# Altium project UdemyCourse.PrjPcb (part 1 of 3)
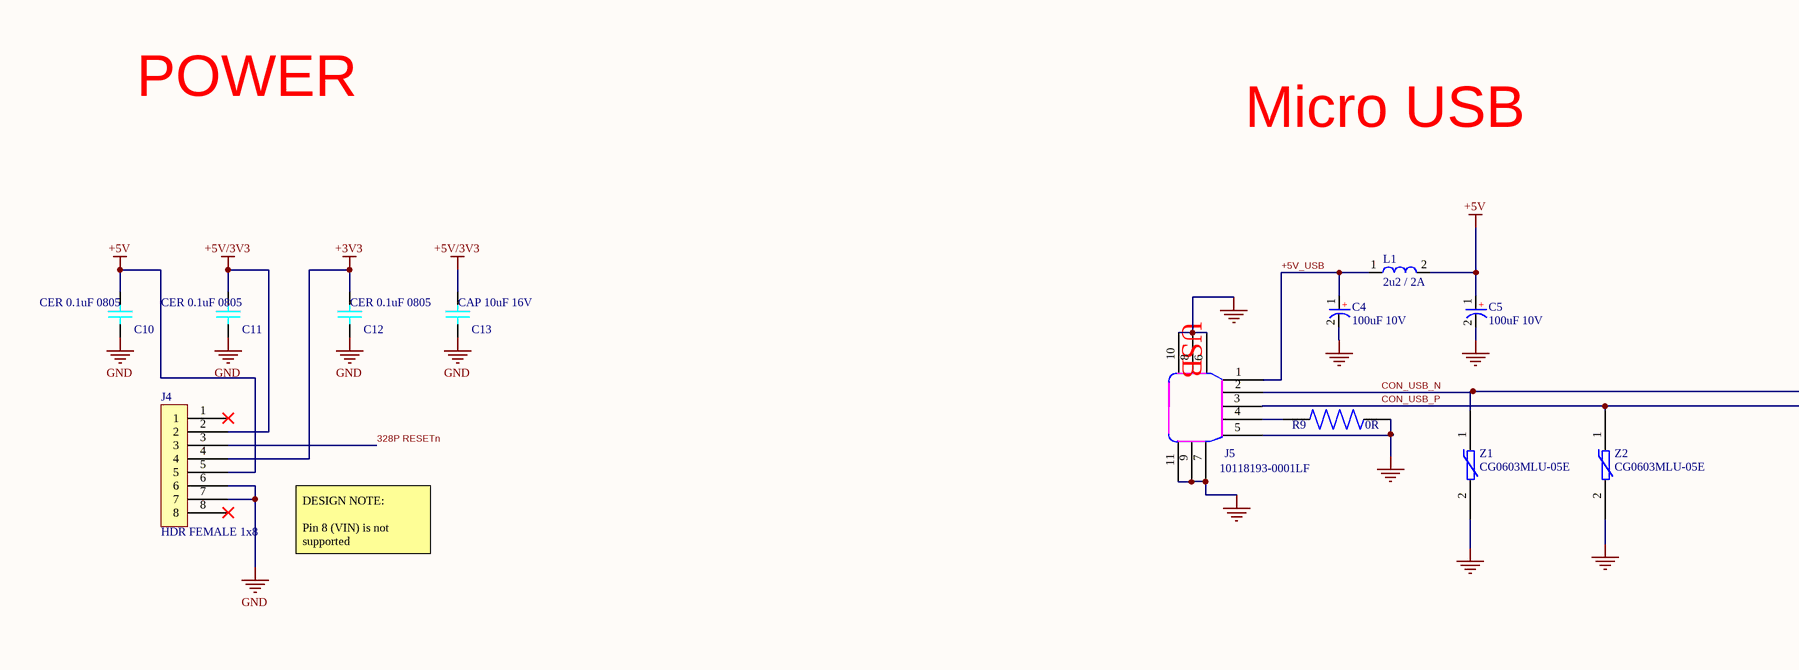
[diagram p0: 28Pins.SchDoc, top left]
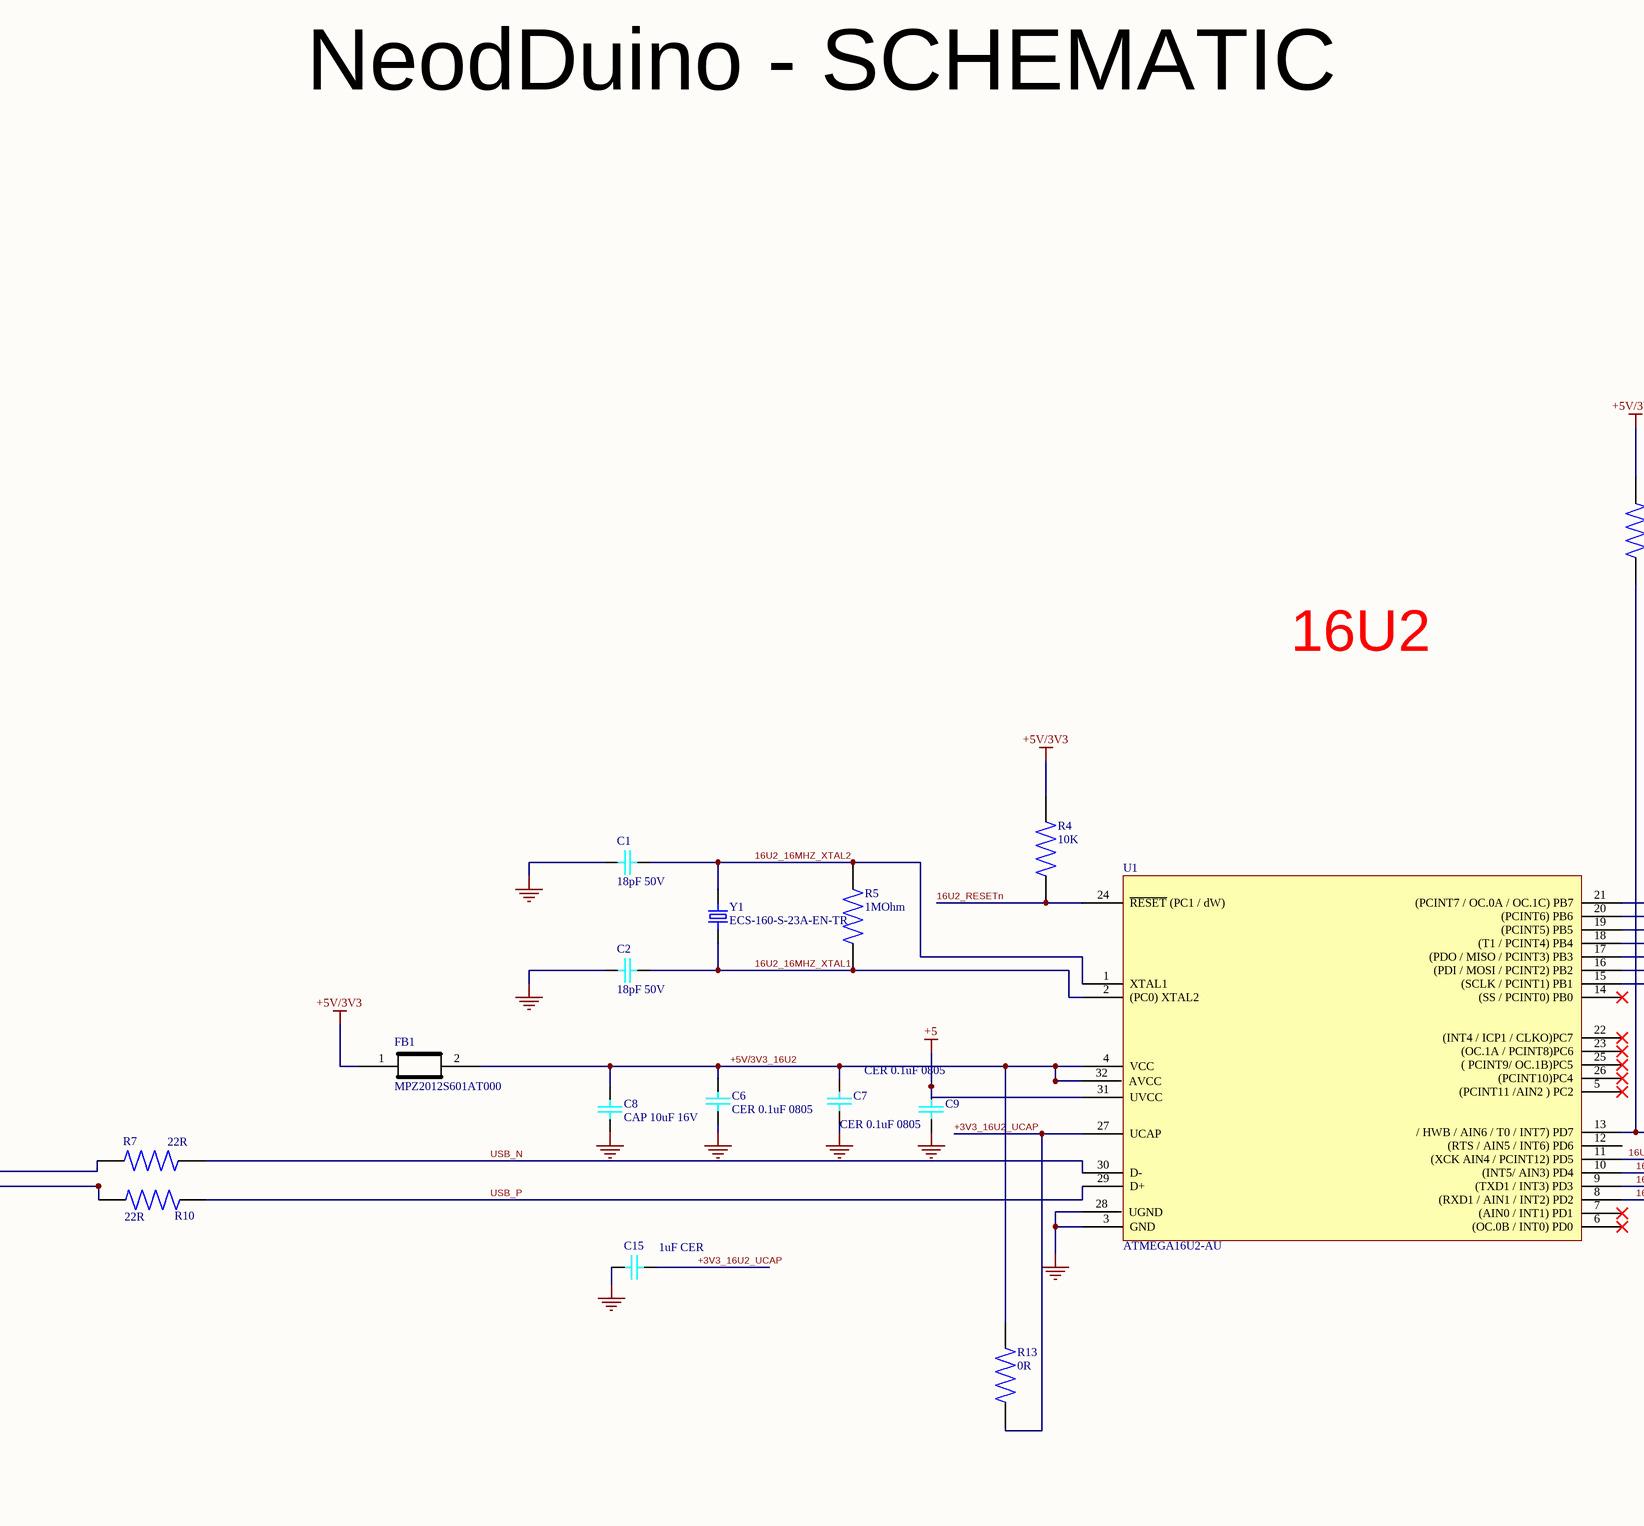
[diagram p1: 28Pins.SchDoc, top middle]
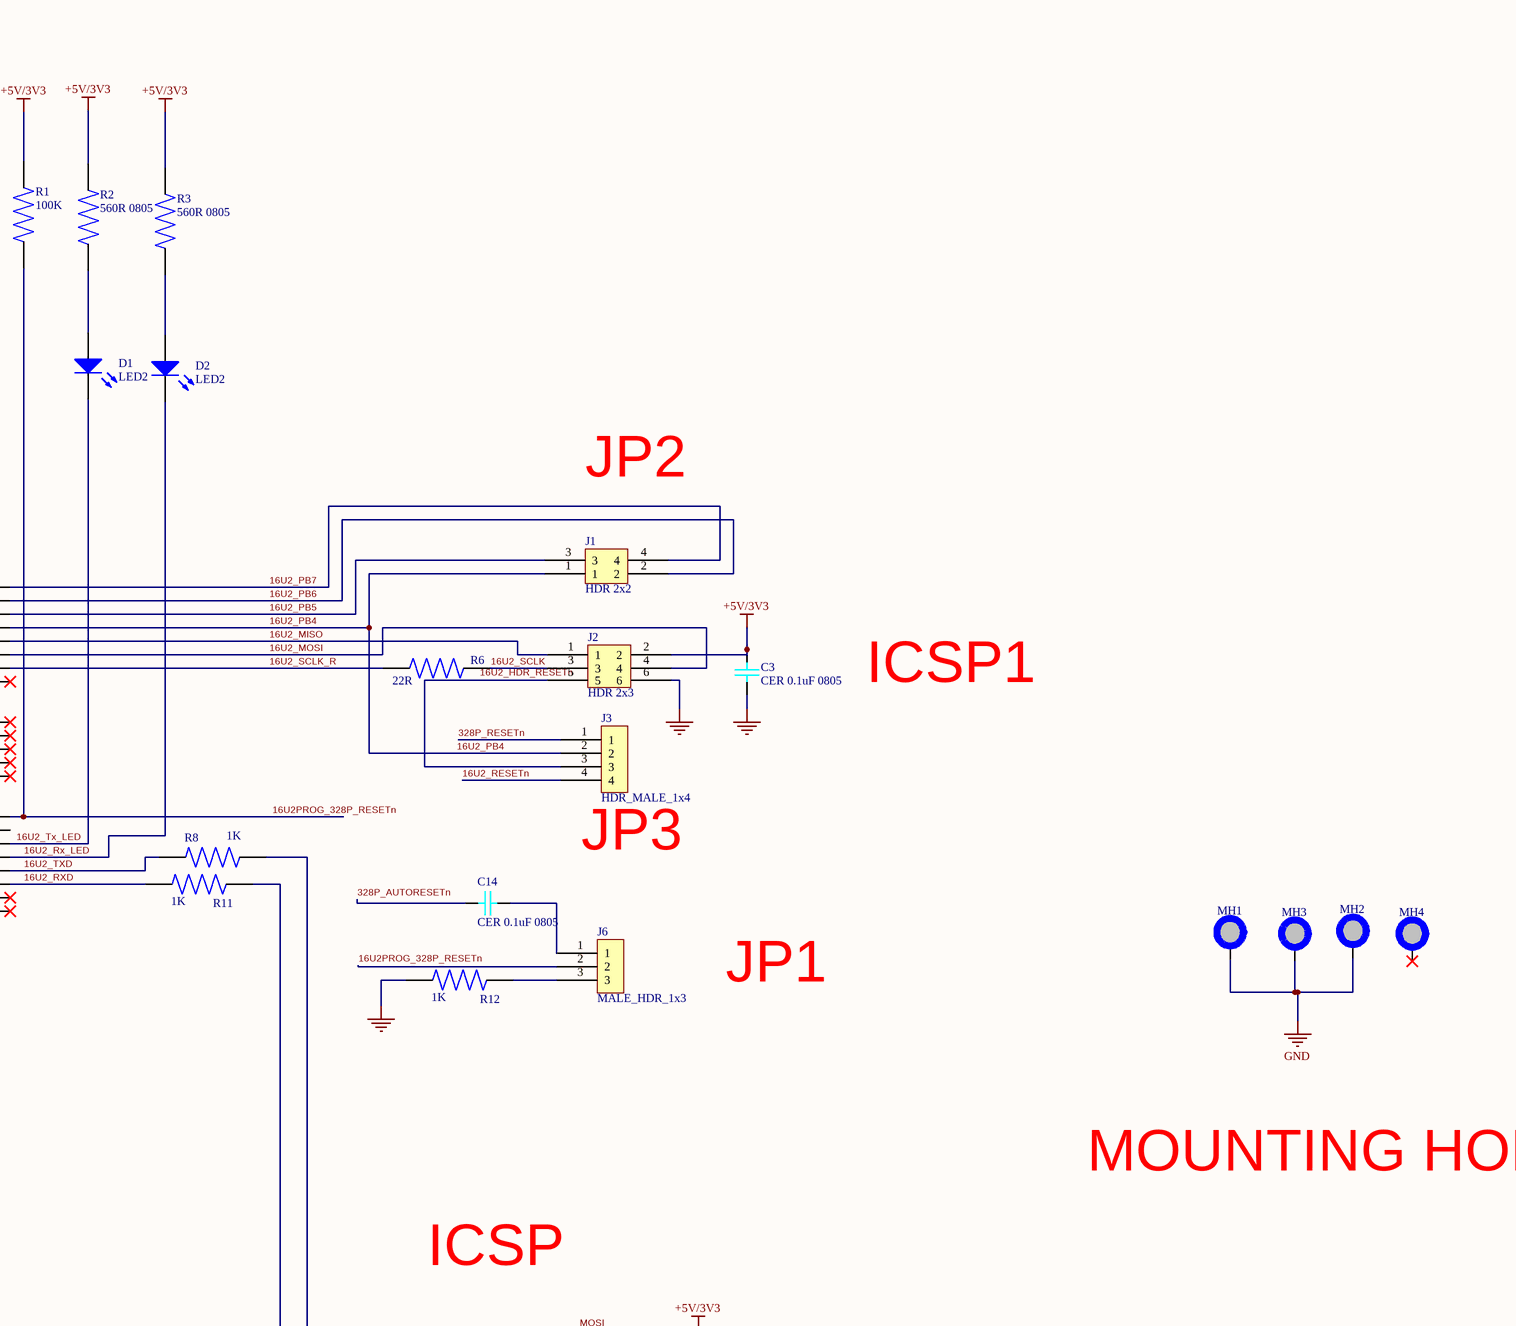
[diagram p2: 28Pins.SchDoc, top right]
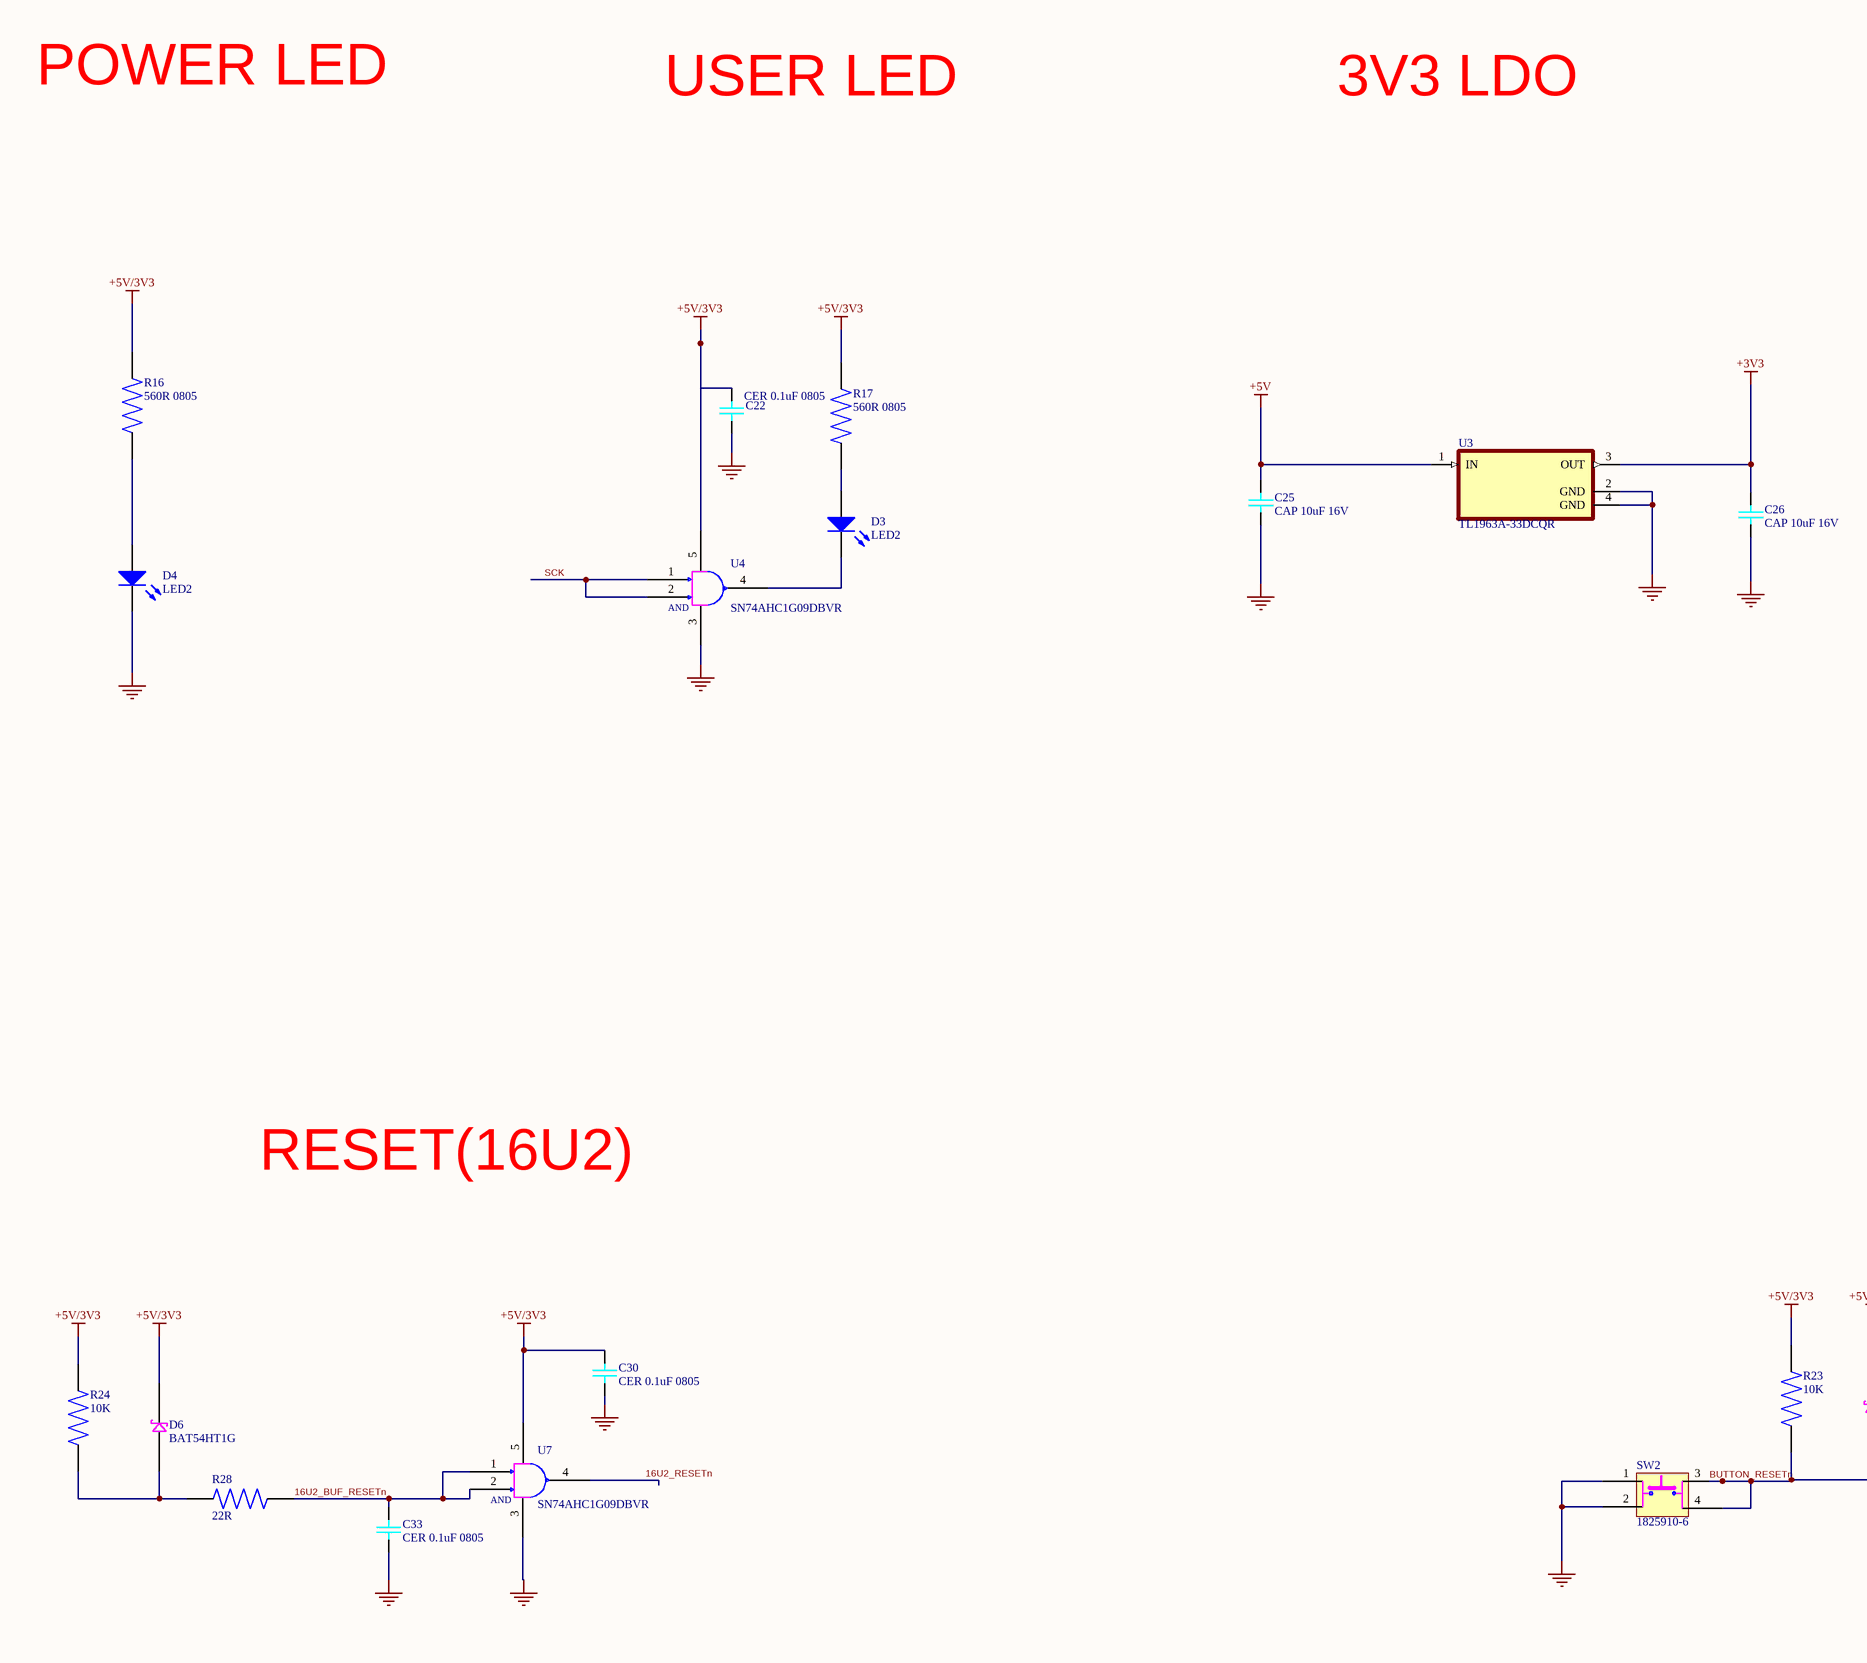
[diagram p3: 28Pins.SchDoc, bottom left]
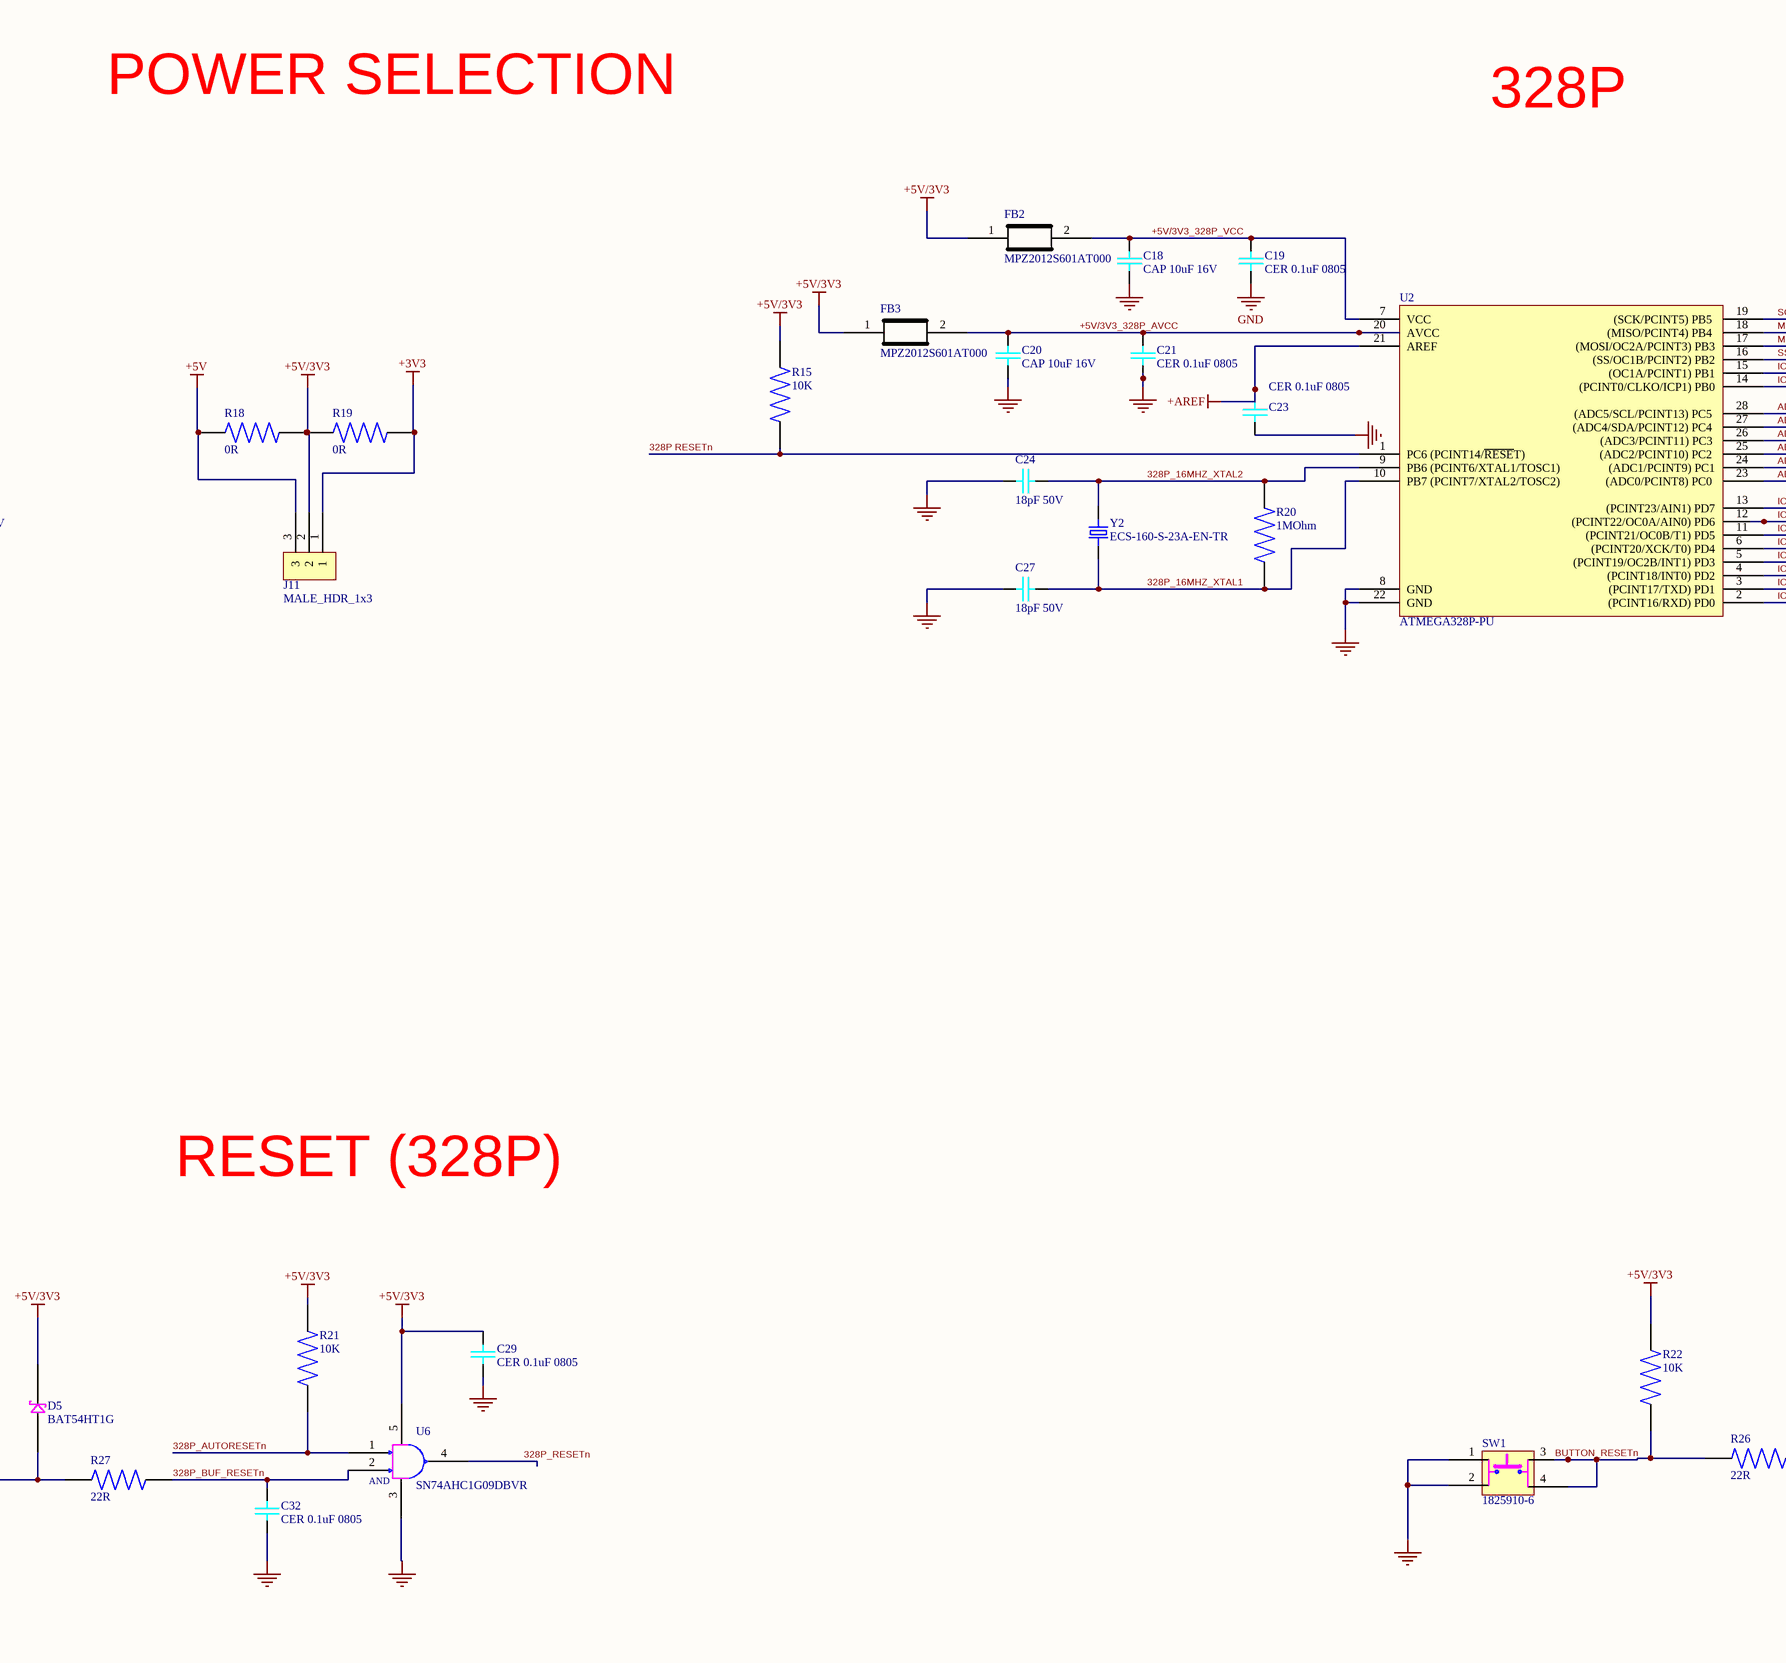
[diagram p4: 28Pins.SchDoc, bottom middle]
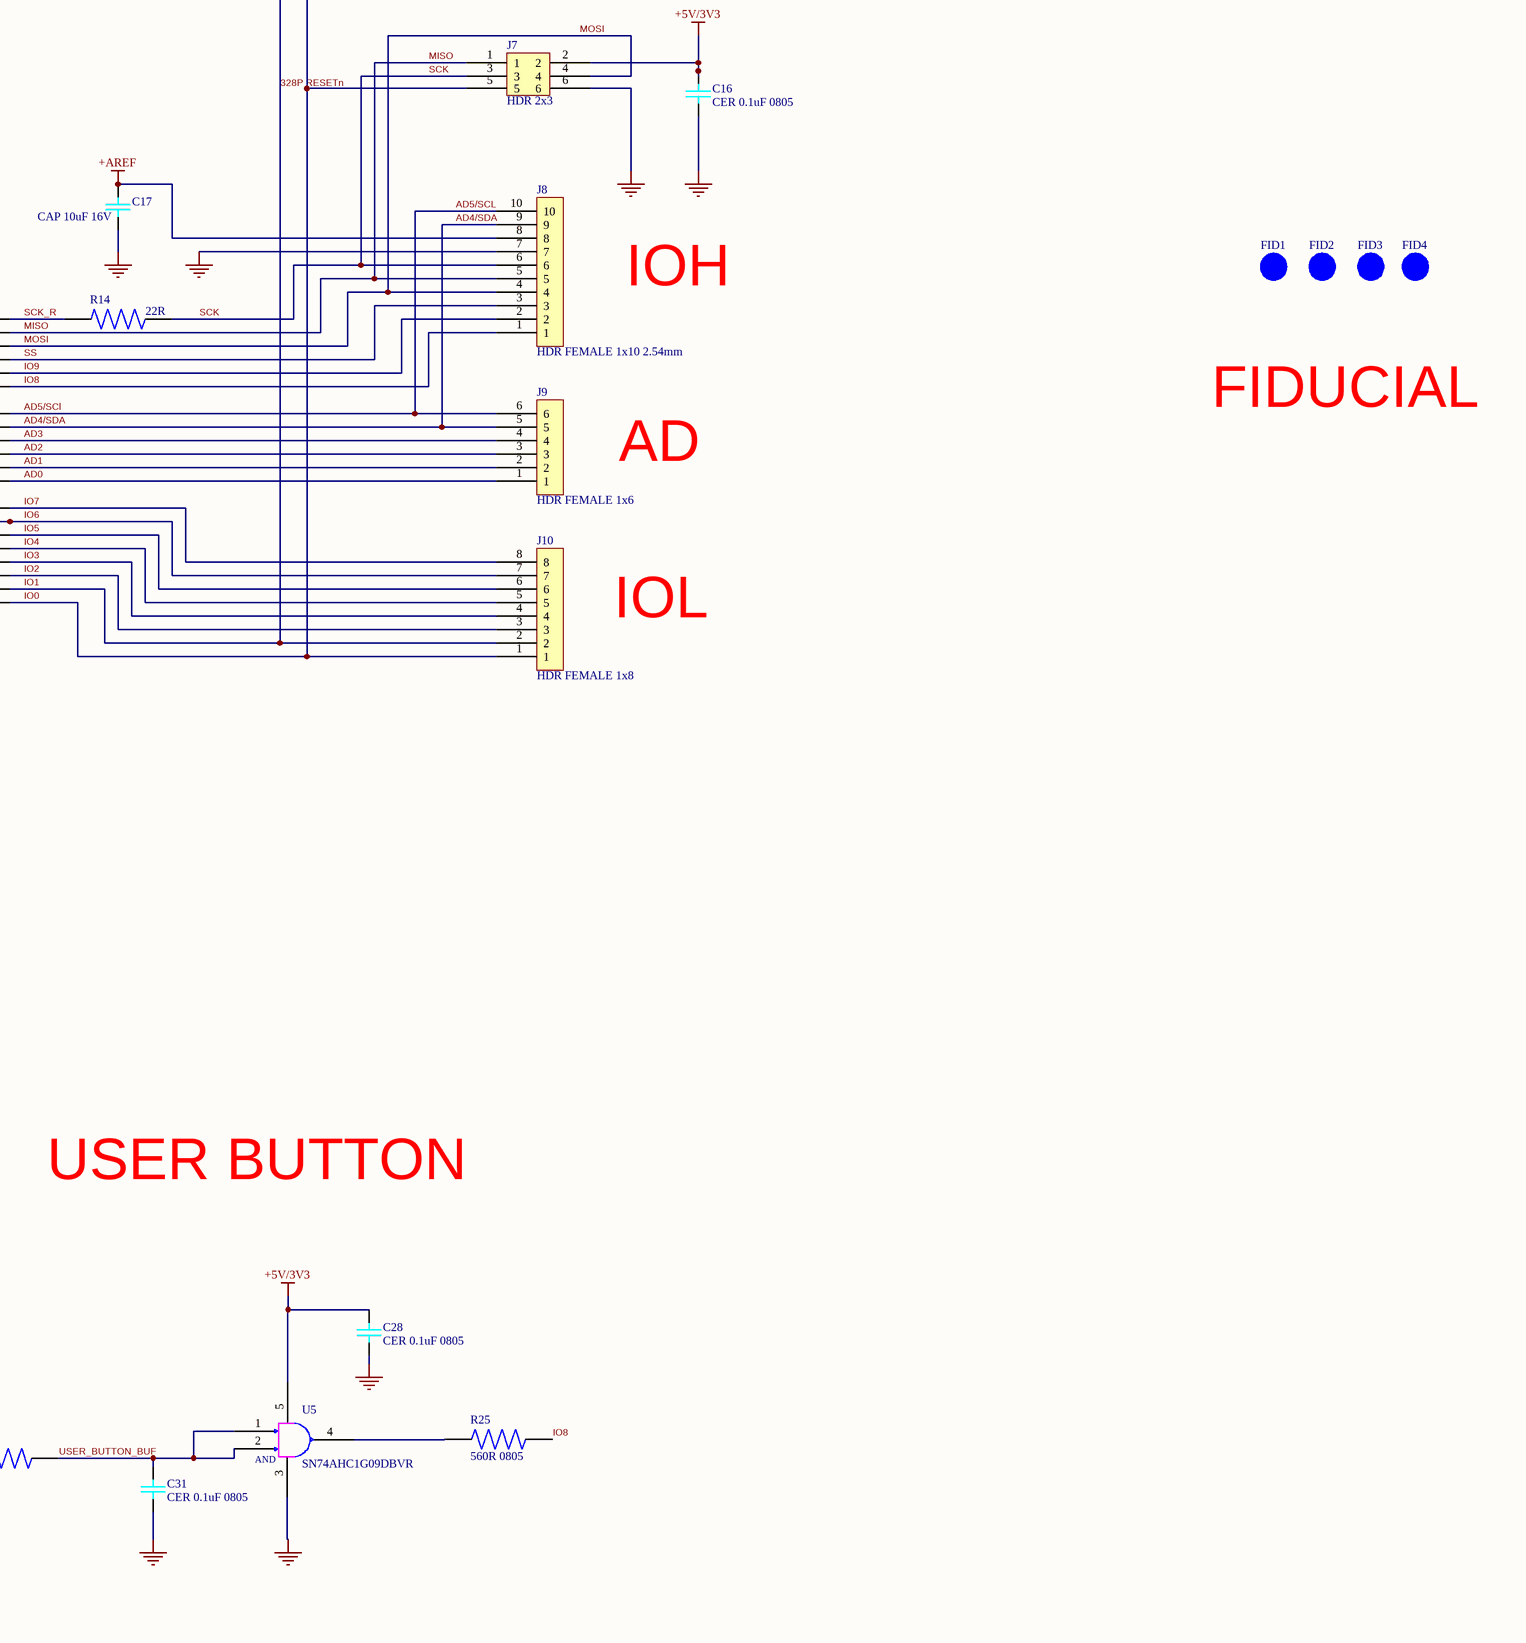
[diagram p5: 28Pins.SchDoc, bottom right]
NotFitted: NF; Title: NeoDuino
1 sheet, 103 parts. Net scope: global (net labels, ports and power ports of the same name join across sheets).
Board file: 28Pin_PCB.PcbDoc

## Sheet 28Pins.SchDoc: NeoDuino
size A0

### Parts
C1  18pF 50V  [C0805]
C2  18pF 50V  [C0805]
C3  CER 0.1uF 0805  [C0805]
C4  100uF 10V  [C_ALUMINIUM_100u]
C5  100uF 10V  [C_ALUMINIUM_100u]
C6  CER 0.1uF 0805  [C0805]
C7  CER 0.1uF 0805  [C0805]
C8  CAP 10uF 16V  [C0805_10uF]
C9  CER 0.1uF 0805  [C0805]
C10  CER 0.1uF 0805  [C0805]
C11  CER 0.1uF 0805  [C0805]
C12  CER 0.1uF 0805  [C0805]
C13  CAP 10uF 16V  [C0805_10uF]
C14  CER 0.1uF 0805  [C0805]
C15  1uF CER  [C0805]
C16  CER 0.1uF 0805  [C0805]
C17  CAP 10uF 16V  [C0805_10uF]
C18  CAP 10uF 16V  [C0805_10uF]
C19  CER 0.1uF 0805  [C0805]
C20  CAP 10uF 16V  [C0805_10uF]
C21  CER 0.1uF 0805  [C0805]
C22  CER 0.1uF 0805  [C0805]
C23  CER 0.1uF 0805  [C0805]
C24  18pF 50V  [C0805]
C25  CAP 10uF 16V  [C0805_10uF]
C26  CAP 10uF 16V  [C0805_10uF]
C27  18pF 50V  [C0805]
C28  CER 0.1uF 0805  [C0805]
C29  CER 0.1uF 0805  [C0805]
C30  CER 0.1uF 0805  [C0805]
C31  CER 0.1uF 0805  [C0805]
C32  CER 0.1uF 0805  [C0805]
C33  CER 0.1uF 0805  [C0805]
D1  LED2  [3.2X1.6X1.1]
D2  LED2  [3.2X1.6X1.1]
D3  LED2  [3.2X1.6X1.1]
D4  LED2  [3.2X1.6X1.1]
D5  BAT54HT1G  [SOD323_DIODE]
D6  BAT54HT1G  [SOD323_DIODE]
FB1  MPZ2012S601AT000  [C0805]
FB2  MPZ2012S601AT000  [C0805]
FB3  MPZ2012S601AT000  [C0805]
FID1  FID_1MMC  [FID_40x120MM]  (value not drawn)  (no BOM)
FID2  FID_1MMC  [FID_40x120MM]  (value not drawn)  (no BOM)
FID3  FID_1MMC  [FID_40x120MM]  (value not drawn)  (no BOM)
FID4  FID_1MMC  [FID_40x120MM]  (value not drawn)  (no BOM)
J1  HDR 2x2  [HDR_2x2_2.54MM]
J2  HDR 2x3  [HDR_2x3_2.54MM]
J3  HDR_MALE_1x4  [HDR_MALE_1x4]
J4  HDR FEMALE 1x8  [HDR_FEMALE_1x8]
J5  10118193-0001LF  [USB_micro]
J6  MALE_HDR_1x3  [HDR_MALE_1x3]
J7  HDR 2x3  [HDR_2x3_2.54MM]
J8  HDR FEMALE 1x10 2.54mm  [HDR_FEMALE_1x10]
J9  HDR FEMALE 1x6  [HDR_FEMALE_1x6]
J10  HDR FEMALE 1x8  [HDR_FEMALE_1x8]
J11  MALE_HDR_1x3  [HDR_MALE_1x3]
L1  2u2 / 2A  [CL10INDUCTOR]
MH1  MH_7.4_3.3MM  [MH_7.4MM_3.2MMDRILL_NOPT]  (value not drawn)  (no BOM)
MH2  MH_7.4_3.3MM  [MH_7.4MM_3.2MMDRILL_NOPT]  (value not drawn)  (no BOM)
MH3  MH_7.4_3.3MM  [MH_7.4MM_3.2MMDRILL_NOPT]  (value not drawn)  (no BOM)
MH4  MH_7.4_3.3MM  [MH_7.4MM_3.2MMDRILL_NOPT]  (value not drawn)  (no BOM)
R1  100K  [RESC2012X65N]
R2  560R 0805  [RESC2012X65N]
R3  560R 0805  [RESC2012X65N]
R4  10K  [RESC2012X65N]
R5  1MOhm  [RESC2012X65N]
R6  22R  [RESC2012X65N]
R7  22R  [RESC2012X65N]
R8  1K  [RESC2012X65N]
R9  0R  [RESC2012X65N]
R10  22R  [RESC2012X65N]
R11  1K  [RESC2012X65N]
R12  1K  [RESC2012X65N]
R13  0R  [RESC2012X65N]
R14  22R  [RESC2012X65N]
R15  10K  [RESC2012X65N]
R16  560R 0805  [RESC2012X65N]
R17  560R 0805  [RESC2012X65N]
R18  0R  [RESC2012X65N]
R19  0R  [RESC2012X65N]
R20  1MOhm  [RESC2012X65N]
R21  10K  [RESC2012X65N]
R22  10K  [RESC2012X65N]
R23  10K  [RESC2012X65N]
R24  10K  [RESC2012X65N]
R25  560R 0805  [RESC2012X65N]
R26  22R  [RESC2012X65N]
R27  22R  [RESC2012X65N]
R28  22R  [RESC2012X65N]
SW1  1825910-6  [SW_ 1825910-6]
SW2  1825910-6  [SW_ 1825910-6]
U1  ATMEGA16U2-AU  [TQFP32]
U2  ATMEGA328P-PU  [DIP28_328P]
U3  TL1963A-33DCQR  [SOT127P706X180-6N]
U4  SN74AHC1G09DBVR  [DBV_SOP_23_5]
U5  SN74AHC1G09DBVR  [DBV_SOP_23_5]
U6  SN74AHC1G09DBVR  [DBV_SOP_23_5]
U7  SN74AHC1G09DBVR  [DBV_SOP_23_5]
Y1  ECS-160-S-23A-EN-TR  [CRYSTAL_16MHz]
Y2  ECS-160-S-23A-EN-TR  [XTAL_ECS-160-S-23A-EN-TR]
Z1  CG0603MLU-05E  [R0603]
Z2  CG0603MLU-05E  [R0603]

### Nets
+3V3: C12.1 C26.2 J4.4 J11.1 R19.2 U3.3(OUT)
+5: C9.2 U1.31(UVCC)
+5V: C5.1 C10.1 C25.2 J4.5 J11.3 L1.2 R18.1 U3.1(IN)
+5V/3V3: C3.2 C11.1 C13.2 C16.2 C22.2 C28.1 C29.1 C30.1 D5.1 D6.1 FB1.1 FB2.1 FB3.1 J2.2 J4.2 J7.2 J11.2 R1.2 R2.1 R3.1 R4.2 R15.2 R16.2 R17.2 R18.2 R19.1 R21.2 R22.1 R23.1 R24.1 U4.5 U5.5 U6.5 U7.5
+AREF: C17.2 C23.2 J8.8 U2.21(AREF)
GND: C1.1 C2.1 C3.1 C4.2 C5.2 C6.1 C7.1 C8.1 C9.1 C10.2 C11.2 C12.2 C13.1 C15.1 C16.1 C17.1 C18.1 C19.1 C20.1 C21.1 C22.1 C23.1 C24.1 C25.1 C26.1 C27.1 C28.2 C29.2 C30.2 C31.1 C32.1 C33.1 D4.2(K) J2.6 J4.6 J4.7 J5.5 J5.6 J5.7 J5.8 J5.9 J5.10 J5.11 J7.6 J8.7 MH1.1 MH2.1 MH3.1 R9.2 R12.1 SW1.1 SW1.2 SW2.1 SW2.2 U1.3(GND) U1.28(UGND) U2.8(GND) U2.22(GND) U3.2(GND) U3.4(GND) U4.3 U5.3 U6.3 U7.3 Z1.2 Z2.2
16U2_16MHZ_XTAL1: C2.2 R5.1 U1.2((PC0)_XTAL2) Y1.1(IN/OUT)
16U2_16MHZ_XTAL2: C1.2 R5.2 U1.1(XTAL1) Y1.2(OUT/IN)
16U2_BUF_RESETn: C33.2 R28.2 U7.1 U7.2
16U2_MISO: J2.1 U1.17((PDO_/_MISO_/_PCINT3)_PB3)
16U2_MOSI: J2.4 U1.16((PDI_/_MOSI_/_PCINT2)_PB2)
16U2_PB4: J1.1 J3.2 U1.18((T1_/_PCINT4)_PB4)
16U2_PB5: J1.3 U1.19((PCINT5)_PB5)
16U2_PB6: J1.2 U1.20((PCINT6)_PB6)
16U2_PB7: J1.4 U1.21((PCINT7_/_OC.0A_/_OC.1C)_PB7)
16U2_RESETn: J3.4 R4.1 U1.24(~{RESET}_(PC1_/_dW)) U7.4
16U2_Rx_LED: D2.2(K) U1.10((INT5/_AIN3)_PD4)
16U2_RXD: R11.1 U1.8((RXD1_/_AIN1_/_INT2)_PD2)
16U2_SCLK: J2.3 R6.2
16U2_SCLK_R: R6.1 U1.15((SCLK_/_PCINT1)_PB1)
16U2_Tx_LED: D1.2(K) U1.11((XCK_AIN4_/_PCINT12)_PD5)
16U2_TXD: R8.1 U1.9((TXD1_/_INT3)_PD3)
16U2PROG_328P_RESETn: J6.2 R1.1 U1.13(/_HWB_/_AIN6_/_T0_/_INT7)_PD7)
328P RESETn: J4.3 J10.2 R11.2 R15.1 U2.1(PC6_(PCINT14/~{RESE}T)) U2.3((PCINT17/TXD)_PD1)  [also labelled IO1]
328P_16MHZ_XTAL1: C27.2 R20.1 U2.10(PB7_(PCINT7/XTAL2/TOSC2)) Y2.1(IN/OUT)
328P_16MHZ_XTAL2: C24.2 R20.2 U2.9(PB6_(PCINT6/XTAL1/TOSC1)) Y2.2(OUT/IN)
328P_AUTORESETn: C14.1 R21.1 U6.1
328P_BUF_RESETn: C32.2 R27.2 U6.2
328P_RESETn: J3.1 U6.4
+3V3_16U2_UCAP: C15.2 R13.1 U1.27(UCAP)
+5V/3V3_16U2: C6.2 C7.2 C8.2 FB1.2 R13.2 U1.4(VCC) U1.32(AVCC)
+5V/3V3_328P_AVCC: C20.2 C21.2 FB3.2 U2.20(AVCC)
+5V/3V3_328P_VCC: C18.2 C19.2 FB2.2 U2.7(VCC)
+5V_USB: C4.1 J5.1 L1.1
AD0: J9.1 U2.23((ADC0/PCINT8)_PC0)
AD1: J9.2 U2.24((ADC1/PCINT9)_PC1)
AD2: J9.3 U2.25((ADC2/PCINT10)_PC2)
AD3: J9.4 U2.26((ADC3/PCINT11)_PC3)
AD4/SDA: J8.9 J9.5 U2.27((ADC4/SDA/PCINT12)_PC4)
AD5/SCl: J8.10 J9.6 U2.28((ADC5/SCL/PCINT13)_PC5)
BUTTON_RESETn: D5.2 R22.2 R23.2 R26.1 R27.1 SW1.3 SW1.4 SW2.3 SW2.4
CON_USB_N: J5.2 R7.1 Z1.1
CON_USB_P: J5.3 R10.1 Z2.1
IO0: J7.5 J10.1 R8.2 U2.2((PCINT16/RXD)_PD0)
IO2: J10.3 U2.4((PCINT18/INT0)_PD2)
IO3: J10.4 U2.5((PCINT19/OC2B/INT1)_PD3)
IO4: J10.5 U2.6((PCINT20/XCK/T0)_PD4)
IO5: J10.6 U2.11((PCINT21/OC0B/T1)_PD5)
IO6: J10.7 U2.12((PCINT22/OC0A/AIN0)_PD6)
IO7: J10.8 U2.13((PCINT23/AIN1)_PD7)
IO8: J8.1 R25.2 U2.14((PCINT0/CLKO/ICP1)_PB0)
IO9: J8.2 U2.15((OC1A/PCINT1)_PB1)
MISO: J7.1 J8.5 U2.18((MISO/PCINT4)_PB4)
MOSI: J7.4 J8.4 U2.17((MOSI/OC2A/PCINT3)_PB3)
SCK: J7.3 J8.6 R14.2 U4.1 U4.2
SCK_R: R14.1 U2.19((SCK/PCINT5)_PB5)
SS: J8.3 U2.16((SS/OC1B/PCINT2)_PB2)
USB_N: R7.2 U1.30(D-)
USB_P: R10.2 U1.29(D+)
USER_BUTTON_BUF: C31.2 R26.2 U5.1 U5.2
NetC14_2: C14.2 J6.1
NetD1_1: D1.1(A) R2.2
NetD2_1: D2.1(A) R3.2
NetD3_1: D3.1(A) R17.1
NetD3_2: D3.2(K) U4.4
NetD4_1: D4.1(A) R16.1
NetD6_2: D6.2 R24.2 R28.1
NetJ2_5: J2.5 J3.3
NetJ5_4: J5.4 R9.1
NetJ6_3: J6.3 R12.2
NetR25_1: R25.1 U5.4

Not connected (* = marked no-connect by the designer): J4 1* 8*; MH4 1*; U1 5((PCINT11_/AIN2_)_PC2)* 6((OC.0B_/_INT0)_PD0)* 7((AIN0_/_INT1)_PD1)* 12((RTS_/_AIN5_/_INT6)_PD6) 14((SS_/_PCINT0)_PB0)* 22((INT4_/_ICP1_/_CLKO)PC7)* 23((OC.1A_/_PCINT8)PC6)* 25((_PCINT9/_OC.1B)PC5)* 26((PCINT10)PC4)*

### Notes on the sheet
- NeodDuino - SCHEMATIC
- 16U2
- JP2
- POWER
- Micro USB
- ICSP1
- (near J3) JP3
- DESIGN NOTE:
  Pin 8 (VIN) is not
  supported
- JP1
- MOUNTING HOLES
- ICSP
- POWER LED
- USER LED
- 3V3 LDO
- POWER SELECTION
- 328P
- IOH
- AD
- FIDUCIAL
- IOL
- RESET(16U2)
- RESET (328P)
- USER BUTTON
- Labels drawn without touching a wire or pin: 16U2_HDR_RESETn
- (in symbol 10118193-0001LF) USB
- (in symbol EEE-HA1A101P) +
- (in symbol SN74AHC1G09DBVR) AND